# Altium schematic sheet shift-registers.SchDoc: Shift Registers
size A3; DocumentNumber: 6; SheetNumber: 6; SheetTotal: 9
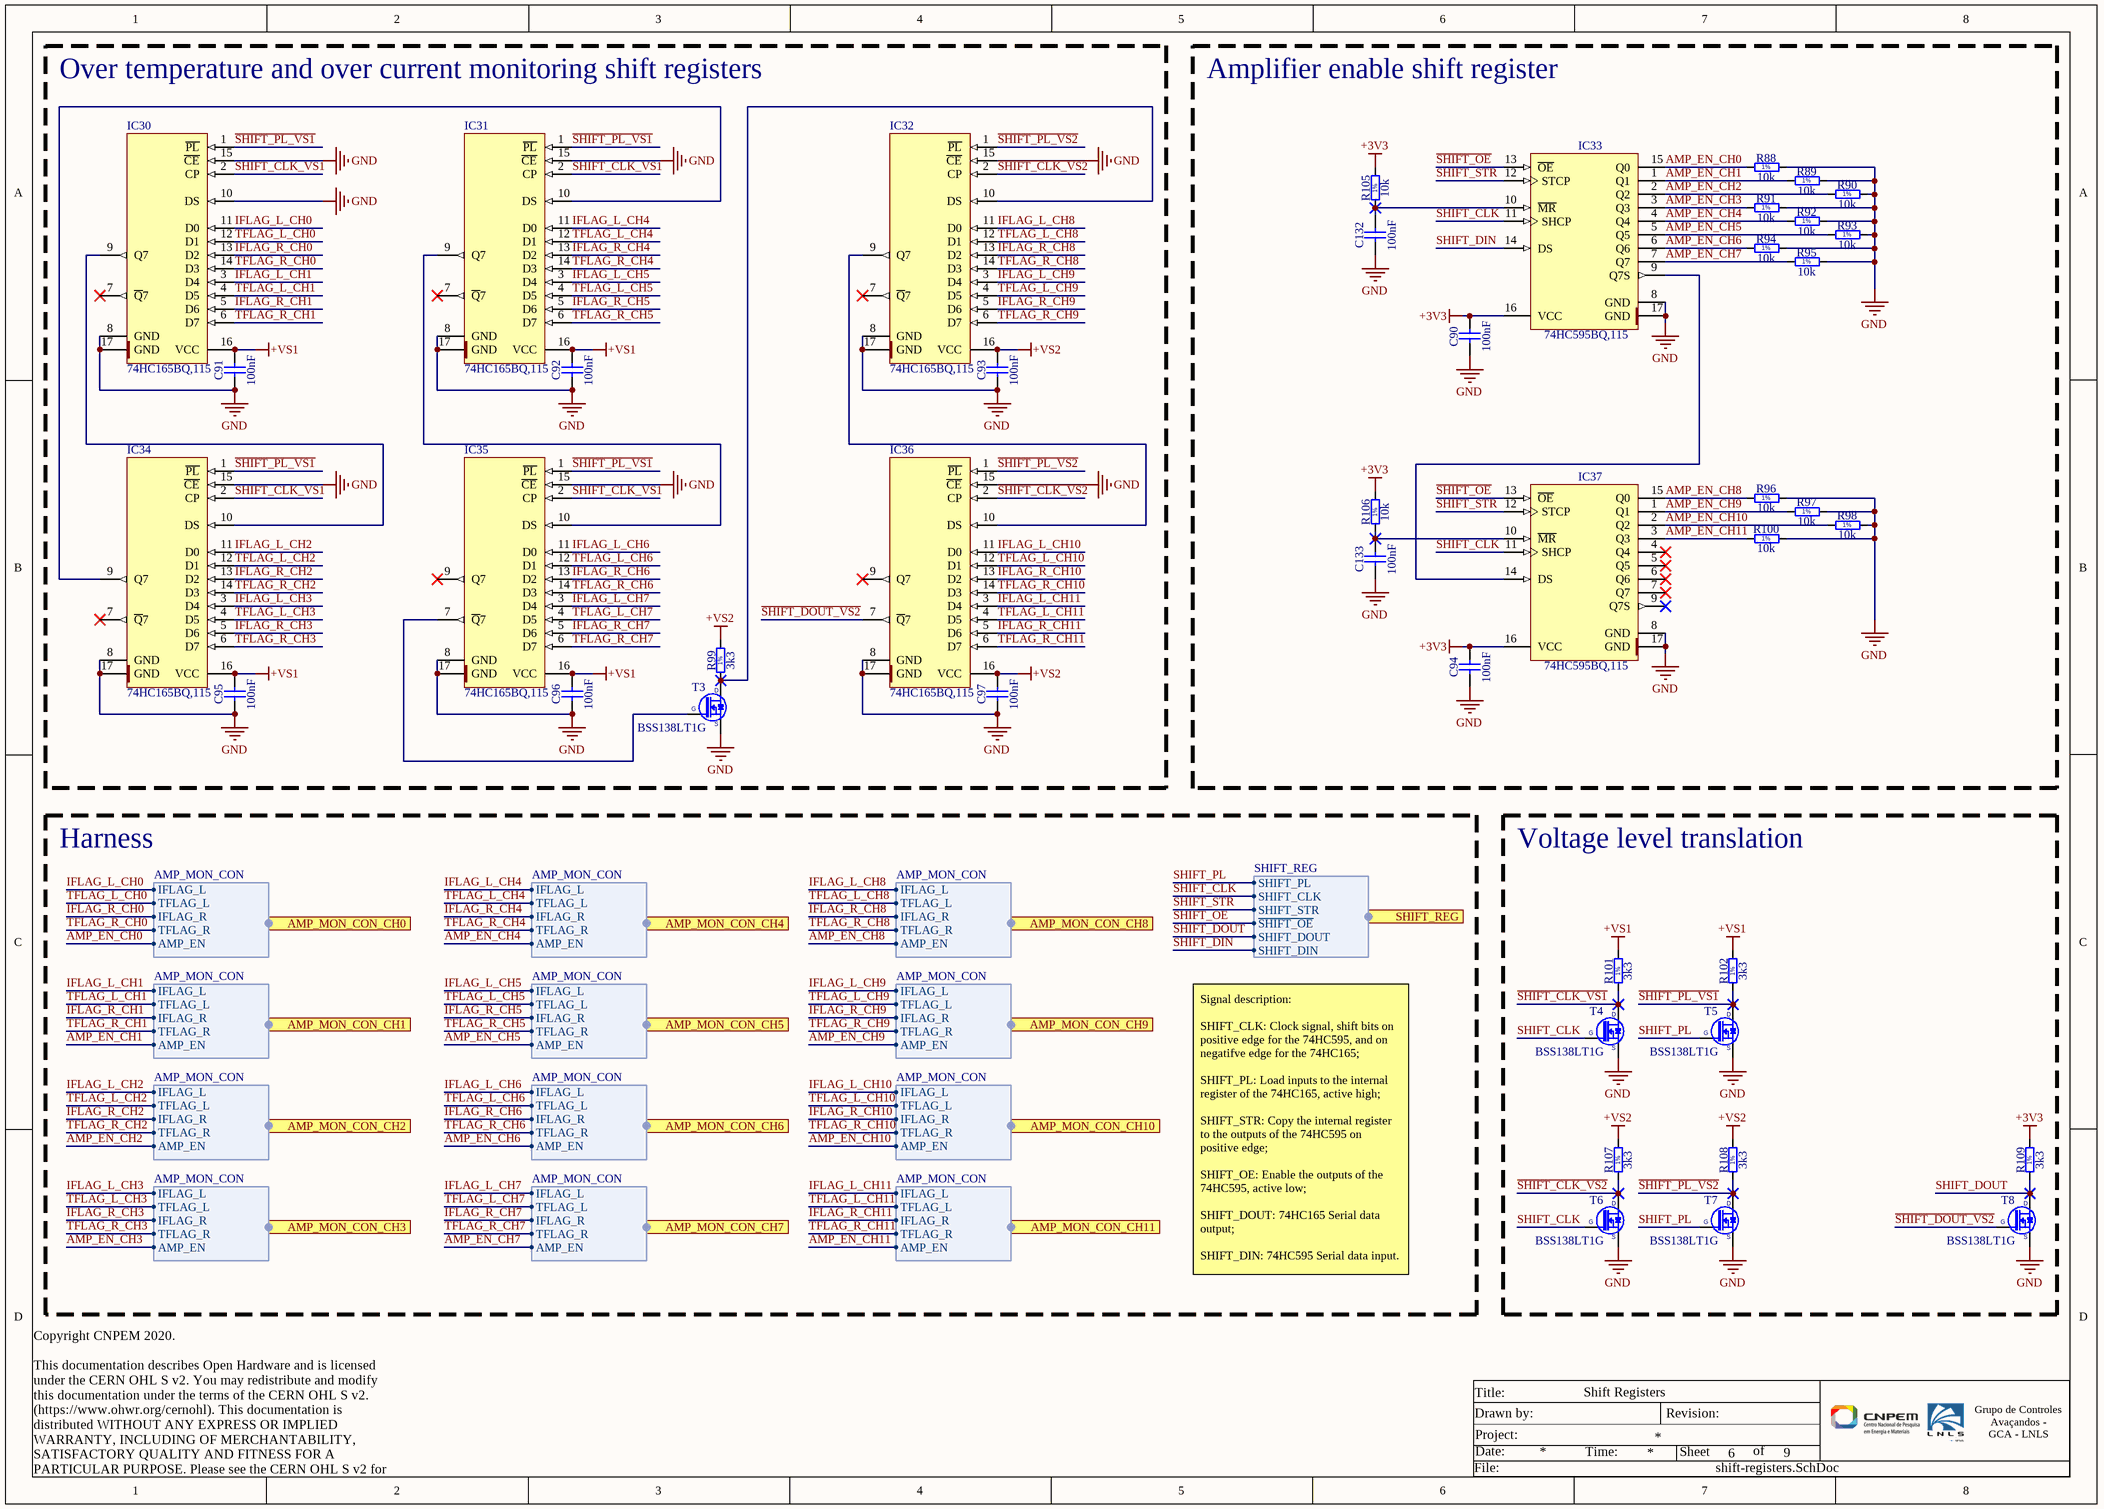
[diagram p0: shift-registers.SchDoc]

## Parts
C90  100nF  [CAPC1005X55N]
C91  100nF  [CAPC1005X55N]
C92  100nF  [CAPC1005X55N]
C93  100nF  [CAPC1005X55N]
C94  100nF  [CAPC1005X55N]
C95  100nF  [CAPC1005X55N]
C96  100nF  [CAPC1005X55N]
C97  100nF  [CAPC1005X55N]
C132  100nF  [CAPC1005X55N]
C133  100nF  [CAPC1005X55N]
IC30  74HC165BQ,115  [DHVQFN16]
IC31  74HC165BQ,115  [DHVQFN16]
IC32  74HC165BQ,115  [DHVQFN16]
IC33  74HC595BQ,115  [DHVQFN16]
IC34  74HC165BQ,115  [DHVQFN16]
IC35  74HC165BQ,115  [DHVQFN16]
IC36  74HC165BQ,115  [DHVQFN16]
IC37  74HC595BQ,115  [DHVQFN16]
R88  10k  [RESC1005X40N]
R89  10k  [RESC1005X40N]
R90  10k  [RESC1005X40N]
R91  10k  [RESC1005X40N]
R92  10k  [RESC1005X40N]
R93  10k  [RESC1005X40N]
R94  10k  [RESC1005X40N]
R95  10k  [RESC1005X40N]
R96  10k  [RESC1005X40N]
R97  10k  [RESC1005X40N]
R98  10k  [RESC1005X40N]
R99  3k3  [RESC1005X40N]
R100  10k  [RESC1005X40N]
R101  3k3  [RESC1005X40N]
R102  3k3  [RESC1005X40N]
R105  10k  [RESC1005X40N]
R106  10k  [RESC1005X40N]
R107  3k3  [RESC1005X40N]
R108  3k3  [RESC1005X40N]
R109  3k3  [RESC1005X40N]
T3  BSS138LT1G  [SOT95P240X110-3N]
T4  BSS138LT1G  [SOT95P240X110-3N]
T5  BSS138LT1G  [SOT95P240X110-3N]
T6  BSS138LT1G  [SOT95P240X110-3N]
T7  BSS138LT1G  [SOT95P240X110-3N]
T8  BSS138LT1G  [SOT95P240X110-3N]

## Blocks framed on the sheet
Over temperature and over current monitoring shift registers: C91-C93 C95-C97 IC30-IC32 IC34-IC36 R99 T3
Amplifier enable shift register: C90 C94 C132 C133 IC33 IC37 R88-R98 R100 R105 R106
Voltage level translation: R101 R102 R107-R109 T4-T8

## Ports
AMP_MON_CON_CH0 (harness AMP_MON_CON), AMP_MON_CON_CH1 (harness AMP_MON_CON), AMP_MON_CON_CH2 (harness AMP_MON_CON), AMP_MON_CON_CH3 (harness AMP_MON_CON), AMP_MON_CON_CH4 (harness AMP_MON_CON), AMP_MON_CON_CH5 (harness AMP_MON_CON), AMP_MON_CON_CH6 (harness AMP_MON_CON), AMP_MON_CON_CH7 (harness AMP_MON_CON), AMP_MON_CON_CH8 (harness AMP_MON_CON), AMP_MON_CON_CH9 (harness AMP_MON_CON), AMP_MON_CON_CH10 (harness AMP_MON_CON), AMP_MON_CON_CH11 (harness AMP_MON_CON), SHIFT_REG (out, harness SHIFT_REG)

## Harnesses
AMP_MON_CON: IFLAG_L, TFLAG_L, IFLAG_R, TFLAG_R, AMP_EN
SHIFT_REG: SHIFT_PL, SHIFT_CLK, SHIFT_STR, ~{SHIFT_OE}, SHIFT_DOUT, SHIFT_DIN

## Nets
+3V3: C90.2 C94.2 IC33.16(VCC) IC37.16(VCC) R105.2 R106.2 R109.2
+VS1: C91.2 C92.2 C95.2 C96.2 IC30.16(VCC) IC31.16(VCC) IC34.16(VCC) IC35.16(VCC) R101.2 R102.2
+VS2: C93.2 C97.2 IC32.16(VCC) IC36.16(VCC) R99.2 R107.2 R108.2
GND: C90.1 C91.1 C92.1 C93.1 C94.1 C95.1 C96.1 C97.1 C132.1 C133.1 IC30.8(GND) IC30.10(DS) IC30.15(~{CE}) IC30.17(GND) IC31.8(GND) IC31.15(~{CE}) IC31.17(GND) IC32.8(GND) IC32.15(~{CE}) IC32.17(GND) IC33.8(GND) IC33.17(GND) IC34.8(GND) IC34.15(~{CE}) IC34.17(GND) IC35.8(GND) IC35.15(~{CE}) IC35.17(GND) IC36.8(GND) IC36.15(~{CE}) IC36.17(GND) IC37.8(GND) IC37.17(GND) R88.2 R89.2 R90.2 R91.2 R92.2 R93.2 R94.2 R95.2 R96.2 R97.2 R98.2 R100.2 T3.2(S) T4.2(S) T5.2(S) T6.2(S) T7.2(S) T8.2(S)
AMP_EN_CH0: IC33.15(Q0) R88.1 ; port AMP_MON_CON_CH0.AMP_EN
AMP_EN_CH1: IC33.1(Q1) R89.1 ; port AMP_MON_CON_CH1.AMP_EN
AMP_EN_CH2: IC33.2(Q2) R90.1 ; port AMP_MON_CON_CH2.AMP_EN
AMP_EN_CH3: IC33.3(Q3) R91.1 ; port AMP_MON_CON_CH3.AMP_EN
AMP_EN_CH4: IC33.4(Q4) R92.1 ; port AMP_MON_CON_CH4.AMP_EN
AMP_EN_CH5: IC33.5(Q5) R93.1 ; port AMP_MON_CON_CH5.AMP_EN
AMP_EN_CH6: IC33.6(Q6) R94.1 ; port AMP_MON_CON_CH6.AMP_EN
AMP_EN_CH7: IC33.7(Q7) R95.1 ; port AMP_MON_CON_CH7.AMP_EN
AMP_EN_CH8: IC37.15(Q0) R96.1 ; port AMP_MON_CON_CH8.AMP_EN
AMP_EN_CH9: IC37.1(Q1) R97.1 ; port AMP_MON_CON_CH9.AMP_EN
AMP_EN_CH10: IC37.2(Q2) R98.1 ; port AMP_MON_CON_CH10.AMP_EN
AMP_EN_CH11: IC37.3(Q3) R100.1 ; port AMP_MON_CON_CH11.AMP_EN
IFLAG_L_CH0: IC30.11(D0) ; port AMP_MON_CON_CH0.IFLAG_L
IFLAG_L_CH1: IC30.3(D4) ; port AMP_MON_CON_CH1.IFLAG_L
IFLAG_L_CH2: IC34.11(D0) ; port AMP_MON_CON_CH2.IFLAG_L
IFLAG_L_CH3: IC34.3(D4) ; port AMP_MON_CON_CH3.IFLAG_L
IFLAG_L_CH4: IC31.11(D0) ; port AMP_MON_CON_CH4.IFLAG_L
IFLAG_L_CH5: IC31.3(D4) ; port AMP_MON_CON_CH5.IFLAG_L
IFLAG_L_CH6: IC35.11(D0) ; port AMP_MON_CON_CH6.IFLAG_L
IFLAG_L_CH7: IC35.3(D4) ; port AMP_MON_CON_CH7.IFLAG_L
IFLAG_L_CH8: IC32.11(D0) ; port AMP_MON_CON_CH8.IFLAG_L
IFLAG_L_CH9: IC32.3(D4) ; port AMP_MON_CON_CH9.IFLAG_L
IFLAG_L_CH10: IC36.11(D0) ; port AMP_MON_CON_CH10.IFLAG_L
IFLAG_L_CH11: IC36.3(D4) ; port AMP_MON_CON_CH11.IFLAG_L
IFLAG_R_CH0: IC30.13(D2) ; port AMP_MON_CON_CH0.IFLAG_R
IFLAG_R_CH1: IC30.5(D6) ; port AMP_MON_CON_CH1.IFLAG_R
IFLAG_R_CH2: IC34.13(D2) ; port AMP_MON_CON_CH2.IFLAG_R
IFLAG_R_CH3: IC34.5(D6) ; port AMP_MON_CON_CH3.IFLAG_R
IFLAG_R_CH4: IC31.13(D2) ; port AMP_MON_CON_CH4.IFLAG_R
IFLAG_R_CH5: IC31.5(D6) ; port AMP_MON_CON_CH5.IFLAG_R
IFLAG_R_CH6: IC35.13(D2) ; port AMP_MON_CON_CH6.IFLAG_R
IFLAG_R_CH7: IC35.5(D6) ; port AMP_MON_CON_CH7.IFLAG_R
IFLAG_R_CH8: IC32.13(D2) ; port AMP_MON_CON_CH8.IFLAG_R
IFLAG_R_CH9: IC32.5(D6) ; port AMP_MON_CON_CH9.IFLAG_R
IFLAG_R_CH10: IC36.13(D2) ; port AMP_MON_CON_CH10.IFLAG_R
IFLAG_R_CH11: IC36.5(D6) ; port AMP_MON_CON_CH11.IFLAG_R
~{SHIFT_CLK_VS1}: IC30.2(CP) IC31.2(CP) IC34.2(CP) IC35.2(CP) R101.1 T4.3(D)
~{SHIFT_CLK_VS2}: IC32.2(CP) IC36.2(CP) R107.1 T6.3(D)
~{SHIFT_DOUT_VS2}: IC36.7(~{Q}7) T8.1(G)
~{SHIFT_OE}: IC33.13(~{OE}) IC37.13(~{OE}) ; port SHIFT_REG.~{SHIFT_OE}
~{SHIFT_PL_VS1}: IC30.1(~{PL}) IC31.1(~{PL}) IC34.1(~{PL}) IC35.1(~{PL}) R102.1 T5.3(D)
~{SHIFT_PL_VS2}: IC32.1(~{PL}) IC36.1(~{PL}) R108.1 T7.3(D)
SHIFT_CLK: IC33.11(SHCP) IC37.11(SHCP) T4.1(G) T6.1(G) ; port SHIFT_REG.SHIFT_CLK
SHIFT_DIN: IC33.14(DS) ; port SHIFT_REG.SHIFT_DIN
SHIFT_DOUT: R109.1 T8.3(D) ; port SHIFT_REG.SHIFT_DOUT
SHIFT_PL: T5.1(G) T7.1(G) ; port SHIFT_REG.SHIFT_PL
SHIFT_STR: IC33.12(STCP) IC37.12(STCP) ; port SHIFT_REG.SHIFT_STR
TFLAG_L_CH0: IC30.12(D1) ; port AMP_MON_CON_CH0.TFLAG_L
TFLAG_L_CH1: IC30.4(D5) ; port AMP_MON_CON_CH1.TFLAG_L
TFLAG_L_CH2: IC34.12(D1) ; port AMP_MON_CON_CH2.TFLAG_L
TFLAG_L_CH3: IC34.4(D5) ; port AMP_MON_CON_CH3.TFLAG_L
TFLAG_L_CH4: IC31.12(D1) ; port AMP_MON_CON_CH4.TFLAG_L
TFLAG_L_CH5: IC31.4(D5) ; port AMP_MON_CON_CH5.TFLAG_L
TFLAG_L_CH6: IC35.12(D1) ; port AMP_MON_CON_CH6.TFLAG_L
TFLAG_L_CH7: IC35.4(D5) ; port AMP_MON_CON_CH7.TFLAG_L
TFLAG_L_CH8: IC32.12(D1) ; port AMP_MON_CON_CH8.TFLAG_L
TFLAG_L_CH9: IC32.4(D5) ; port AMP_MON_CON_CH9.TFLAG_L
TFLAG_L_CH10: IC36.12(D1) ; port AMP_MON_CON_CH10.TFLAG_L
TFLAG_L_CH11: IC36.4(D5) ; port AMP_MON_CON_CH11.TFLAG_L
TFLAG_R_CH0: IC30.14(D3) ; port AMP_MON_CON_CH0.TFLAG_R
TFLAG_R_CH1: IC30.6(D7) ; port AMP_MON_CON_CH1.TFLAG_R
TFLAG_R_CH2: IC34.14(D3) ; port AMP_MON_CON_CH2.TFLAG_R
TFLAG_R_CH3: IC34.6(D7) ; port AMP_MON_CON_CH3.TFLAG_R
TFLAG_R_CH4: IC31.14(D3) ; port AMP_MON_CON_CH4.TFLAG_R
TFLAG_R_CH5: IC31.6(D7) ; port AMP_MON_CON_CH5.TFLAG_R
TFLAG_R_CH6: IC35.14(D3) ; port AMP_MON_CON_CH6.TFLAG_R
TFLAG_R_CH7: IC35.6(D7) ; port AMP_MON_CON_CH7.TFLAG_R
TFLAG_R_CH8: IC32.14(D3) ; port AMP_MON_CON_CH8.TFLAG_R
TFLAG_R_CH9: IC32.6(D7) ; port AMP_MON_CON_CH9.TFLAG_R
TFLAG_R_CH10: IC36.14(D3) ; port AMP_MON_CON_CH10.TFLAG_R
TFLAG_R_CH11: IC36.6(D7) ; port AMP_MON_CON_CH11.TFLAG_R
NetC132_2: C132.2 IC33.10(~{MR}) R105.1
NetC133_2: C133.2 IC37.10(~{MR}) R106.1
NetIC30_9: IC30.9(Q7) IC34.10(DS)
NetIC31_9: IC31.9(Q7) IC35.10(DS)
NetIC31_10: IC31.10(DS) IC34.9(Q7)
NetIC32_9: IC32.9(Q7) IC36.10(DS)
NetIC32_10: IC32.10(DS) R99.1 T3.3(D)
NetIC33_9: IC33.9(Q7S) IC37.14(DS)
NetIC35_7: IC35.7(~{Q}7) T3.1(G)

Not connected (* = marked no-connect by the designer): IC30 7(~{Q}7)*; IC31 7(~{Q}7)*; IC32 7(~{Q}7)*; IC34 7(~{Q}7)*; IC35 9(Q7)*; IC36 9(Q7)*; IC37 4(Q4)* 5(Q5)* 6(Q6)* 7(Q7)* 9(Q7S)*

## Notes on the sheet
- Harness
- Signal description:
  SHIFT_CLK: Clock signal, shift bits on positive edge for the 74HC595, and on negatifve edge for the 74HC165;
  SHIFT_PL: Load inputs to the internal register of the 74HC165, active high;
  SHIFT_STR: Copy the internal register to the outputs of the 74HC595 on positive edge;
  SHIFT_OE: Enable the outputs of the 74HC595, active low;
  SHIFT_DOUT: 74HC165 Serial data output;
  SHIFT_DIN: 74HC595 Serial data input.
- Title:
- Date:
- Project:
- Drawn by:
- Time:
- Revision:
- Sheet
- of
- Grupo de Controles Avaçandos -
  GCA - LNLS
- Copyright CNPEM 2020.
  This documentation describes Open Hardware and is licensed under the CERN OHL S v2. You may redistribute and modify this documentation under the terms of the CERN OHL S v2. (https://www.ohwr.org/cernohl). This documentation is distributed WITHOUT ANY EXPRESS OR IMPLIED WARRANTY, INCLUDING OF MERCHANTABILITY, SATISFACTORY QUALITY AND FITNESS FOR A PARTICULAR PURPOSE. Please see the CERN OHL S v2 for applicable conditions.
- File:
- (in symbol R0402_3K3_1%_0.0625W_100PPM) 1%
- (in symbol R0402_10K_1%_0.0625W_100PPM) 1%

## Library data of the parts
C90-C97 C132 C133 = CC0402_100NF_16V_10%_X7R: SMD Multilayer Chip Ceramic Capacitor; Manufacturer: GENERIC; Manufacturer1 Part Number: GRM155R71C104KA88D; Voltage: 16V; TC: X7R; Tolerance: ±10%; Part Number: CC0402_100NF_16V_10%_X7R; Component Kind: Standard; Component Type: Standard; Pin Count: 2; Value: 100nF; Status: Not Recommended; Manufacturer Part Number: CC0402_100NF_16V_10%_X7R; Case: 0402; Mounted: Yes; Socket: No; SMD: Yes; Sense: No; Manufacturer1 Example: MURATA; Manufacturer1 ComponentHeight: 0.55mm; HelpURL: \\cern.ch\dfs\Applications\Altium\Datasheets\CC0402_X7R_MURATA_GRM.pdf; Author: CERN DEM JLC; CreateDate: 05/12/2013; LatestRevisionDate: 03/12/2007
IC30-IC32 IC34-IC36 = 74HC165BQ,115: 8-bit parallel-in/serial out shift register; Manufacturer: NEXPERIA; PressFit: No; Bonding: No; Part Number: 74HC165BQ,115; Component Kind: Standard; Component Type: Standard; Device: 74HC165BQ,115; Footprint: DHVQFN-16; PackageDescription: Plastic dual in-line compatible thermal enhanced very thin quad flat package, no leads, 16 terminals, body 2.5 x 3.5 x 0.85 mm; Manufacturer Part Number: 74HC165BQ,115; Pin Count: 17; Case: DHVQFN-16; Mounted: Yes; Socket: No; SMD: Yes; Sense: No; ComponentHeight: 1mm; Author: LNLS DIG AFG; CreateDate: 03/07/2020; LatestRevisionDate: 03/07/2020
IC33 IC37 = 74HC595BQ,115: 8-Bit serial-in, serial or parallel-out shift register with output  latches, Three-state; Manufacturer: NEXPERIA; PressFit: No; Bonding: No; Part Number: 74HC595BQ,115; Component Kind: Standard; Component Type: Standard; Device: 74HC595BQ,115; PackageDescription: Plastic dual in-line compatible thermal enhanced very thin quad flat package, no leads, 16 terminals, body 2.5 x 3.5 x 0.85 mm; Manufacturer Part Number: 74HC595BQ,115; Pin Count: 17; Case: DHVQFN-16; Mounted: Yes; Socket: No; SMD: Yes; Sense: No; ComponentHeight: 1mm; Author: LNLS DIG AFG; CreateDate: 06/07/2020; LatestRevisionDate: 06/07/2020
R88-R98 R100 R105 R106 = R0402_10K_1%_0.0625W_100PPM: General Purpose Thick Film Chip Resistor; Manufacturer: GENERIC; Manufacturer1 Part Number: 232270671003L; TC: ±100ppm/°C; Tolerance: ±1%; Part Number: R0402_10K_1%_0.0625W_100PPM; Component Kind: Standard; Component Type: Standard; Pin Count: 2; Value: 10k; Status: Not recommended; Power: 0.0625W; Manufacturer Part Number: R0402_10K_1%_0.0625W_100PPM; Case: 0402; Mounted: Yes; Sense: No; Socket: No; SMD: Yes; Manufacturer1 Example: YAGEO PHYCOMP; Manufacturer1 ComponentHeight: 0.4mm; HelpURL: \\cern.ch\dfs\Applications\Altium\Datasheets\R0402_Phycomp_RC0402.pdf; Author: CERN DEM JLC; CreateDate: 03/12/2007; LatestRevisionDate: 17/10/2012
R99 R101 R102 R107-R109 = R0402_3K3_1%_0.0625W_100PPM: General Purpose Thick Film Chip Resistor; Manufacturer: GENERIC; Manufacturer1 Part Number: 232270673302L; TC: ±100ppm/°C; Tolerance: ±1%; Part Number: R0402_3K3_1%_0.0625W_100PPM; Component Kind: Standard; Component Type: Standard; Pin Count: 2; Value: 3k3; Status: Not recommended; Power: 0.0625W; Manufacturer Part Number: R0402_3K3_1%_0.0625W_100PPM; Case: 0402; Mounted: Yes; Sense: No; Socket: No; SMD: Yes; Manufacturer1 Example: YAGEO PHYCOMP; Manufacturer1 ComponentHeight: 0.4mm; HelpURL: \\cern.ch\dfs\Applications\Altium\Datasheets\R0402_Phycomp_RC0402.pdf; Author: CERN DEM JLC; CreateDate: 03/12/2007; LatestRevisionDate: 17/10/2012
T3-T8 = BSS138LT1G: 50V 200mA N-Channel Enhancement Mode Field-Effect Transistor; Manufacturer: ON SEMICONDUCTOR; PressFit: No; Bonding: No; Manufacturer Part Number: BSS138LT1G; PackageDescription: SOT23 3-Leads, Pitch 0.95mm - Body 1.4x3mm, IPC Medium Density; Part Number: BSS138LT1G; Component Kind: Standard; Component Type: Standard; Device: BSS138LT1G; Pin Count: 3; Case: SOT23-3; Mounted: Yes; Socket: No; SMD: Yes; Sense: No; ComponentHeight: 1.11mm; HelpURL: \\cern.ch\dfs\Applications\Altium\Datasheets\BSS138LT1G.pdf; Author: CERN DEM JLC; CreateDate: 23/03/2009; LatestRevisionDate: 23/03/2009